# EAGLE design PSUProtector (EAGLE 7.6.0)
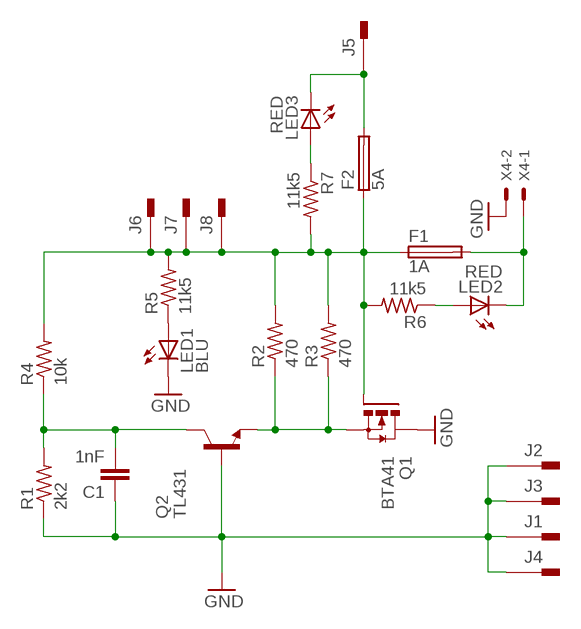
[diagram p0: schematic, sheet 1]

## Parts
C1  1nF  C-EU050-035X075  [C050-035X075]
F1  1A  TR5  [TR5]
F2  5A  TR5  [TR5]
J1  PIN2F061.040  [F061.040]
J2  PIN2F061.040  [F061.040]
J3  PIN2F061.040  [F061.040]
J4  PIN2F061.040  [F061.040]
J5  PIN2F061.040  [F061.040]
J6  PIN2F061.040  [F061.040]
J7  PIN2F061.040  [F061.040]
J8  PIN2F061.040  [F061.040]
LED1  BLU  LED5MM  [LED5MM]
LED2  RED  LED5MM  [LED5MM]
LED3  RED  LED5MM  [LED5MM]
Q1  BTA41  IRFP240  [TO247BV]
Q2  TL431  BC449  [TO92-EBC]
R1  2k2  R-US_0309/12  [0309/12]
R2  470  R-US_0411/15  [0411/15]
R3  470  R-US_0411/15  [0411/15]
R4  10k  R-US_0309/12  [0309/12]
R5  11k5  R-US_0309/12  [0309/12]
R6  11k5  R-US_0309/12  [0309/12]
R7  11k5  R-US_0309/12  [0309/12]
X4  KK-156-2  [KK-156-2]

## Nets
GND: C1.1 J1.A1 J1.A2 J2.A1 J2.A2 J3.A1 J3.A2 J4.A1 J4.A2 LED1.K(C) Q1.D Q2.B R1.1 X4.2
N$1: Q1.S Q2.E R2.1 R3.1
N$2: F1.1 F2.1 J6.A1 J6.A2 J7.A1 J7.A2 J8.A1 J8.A2 Q1.G R2.2 R3.2 R4.2 R5.2 R6.2 R7.2
N$3: C1.2 Q2.C R1.2 R4.1
N$4: LED3.A R7.1
N$5: F2.2 J5.A1 J5.A2 LED3.K(C)
N$6: LED1.A R5.1
N$7: F1.2 LED2.K(C) X4.1
N$8: LED2.A R6.1

## Library data of the parts
C1 = resistor:C-EU: CAPACITOR, European symbol
F1 F2 = fuse:TR5: FUSE Wickmann; OC_FARNELL: unknown; OC_NEWARK: unknown
J1-J8 = con-faston:PIN2: Flachstecker Typ Tyco/Electronics/AMP TAB, FASTON Printed Circuit Board Tabs Source: http://www.buerklin.com, http://catalog.tycoelectronics.com; OC_FARNELL: unknown; OC_NEWARK: unknown
LED1-LED3 = led:LED: LED OSRAM: - CHIPLED LG R971, LG N971, LY N971, LG Q971, LY Q971, LO R971, LY R971 LH N974, LH R974 LS Q976, LO Q976, LY Q976 LO Q996 - Hyper CHIPLED LW Q18S LB Q993, LB Q99A, LB R99A - SideLED LS A670, LO A670, LY A670, LG A670, LP A670 LB A673, LV A673, LT A673, LW A673 LH A674 LY A675 LS A676, LA A676, LO A676, LY A676, LW A676 LS A679, LY A679, LG A679 - Hyper Micro SIDELED® LS Y876, LA Y876, LO Y876, LY Y876 LT Y87S - SmartLED LW L88C, LW L88S LB L89C, LB L89S, LG L890 LS L89K, LO L89K, LY L89K LS L896, LA L896, LO L896, LY L896 - TOPLED LS T670, LO T670, LY T670, LG T670, LP T670 LSG T670, LSP T670, LSY T670, LOP T670, LYG T670 LG T671, LOG T671, LSG T671 LB T673, LV T673, LT T673, LW T673 LH T674 LS T676, LA T676, LO T676, LY T676, LB T676, LH T676, LSB T676, LW T676 LB T67C, LV T67C, LT T67C, LS T67K, LO T67K, LY T67K, LW E67C LS E67B, LA E67B, LO E67B, LY E67B, LB E67C, LV E67C, LT E67C LW T67C LS T679, LY T679, LG T679 LS T770, LO T770, LY T770, LG T770, LP T770 LB T773, LV T773, LT T773, LW T773 LH T774 LS E675, LA E675, LY E675, LS T675 LS T776, LA T776, LO T776, LY T776, LB T776 LHGB T686 LT T68C, LB T68C - Hyper Mini TOPLED® LB M676 - Mini TOPLED Santana® LG M470 LS M47K, LO M47K, LY M47K Source: http://www.osram.convergy.de LUXEON: - LUMILED® LXK2-PW12-R00, LXK2-PW12-S00, LXK2-PW14-U00, LXK2-PW14-V00 LXK2-PM12-R00, LXK2-PM12-S00, LXK2-PM14-U00 LXK2-PE12-Q00, LXK2-PE12-R00, LXK2-PE12-S00, LXK2-PE14-T00, LXK2-PE14-U00 LXK2-PB12-K00, LXK2-PB12-L00, LXK2-PB12-M00, LXK2-PB14-N00, LXK2-PB14-P00, LXK2-PB14-Q00 LXK2-PR12-L00, LXK2-PR12-M00, LXK2-PR14-Q00, LXK2-PR14-R00 LXK2-PD12-Q00, LXK2-PD12-R00, LXK2-PD12-S00 LXK2-PH12-R00, LXK2-PH12-S00 LXK2-PL12-P00, LXK2-PL12-Q00, LXK2-PL12-R00 Source: www.luxeon.com KINGBRIGHT: KA-3528ASYC Source: www.kingbright.com
Q1 = transistor-power:IRFP240: HEXFET Power MosFet Source: http://www.irf.com/
Q2 = transistor-npn:BC449*: NPN Transistor
R1-R7 = resistor:R-US_: RESISTOR, American symbol
X4 = con-molex:KK-156-2: KK 156 HEADER Source: http://www.molex.com/pdm_docs/sd/026604100_sd.pdf; OC_FARNELL: unknown; OC_NEWARK: unknown

## Board
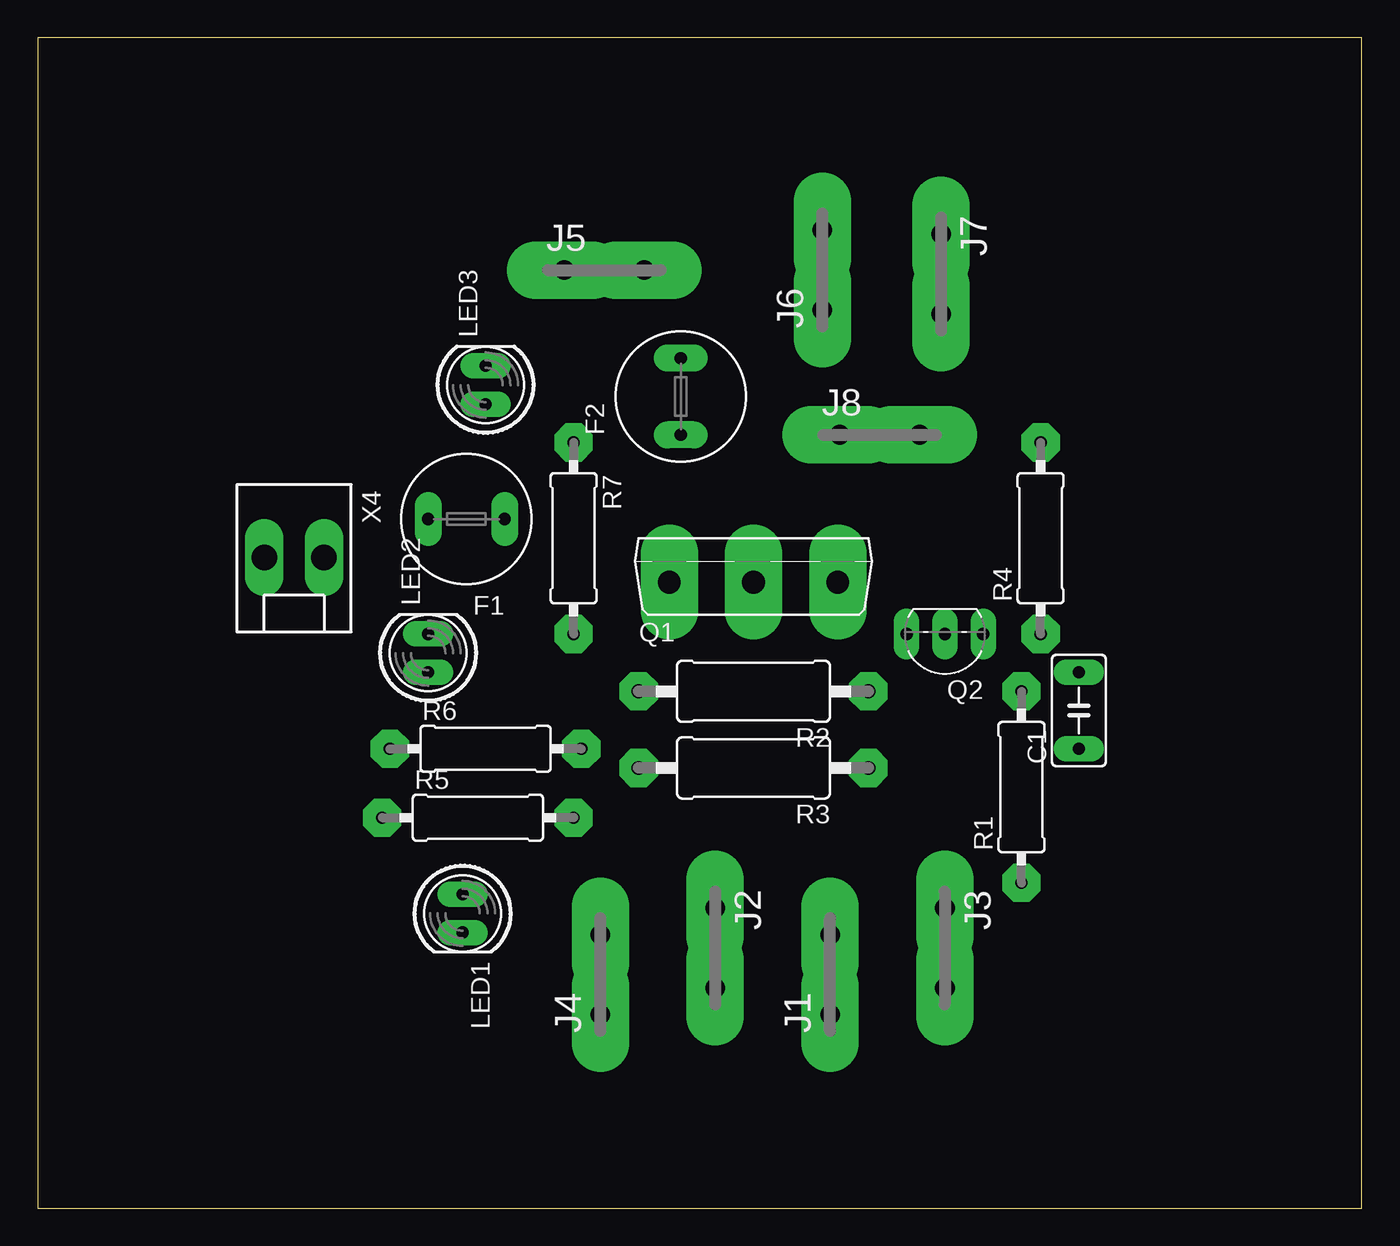
[diagram p1: board, top side]
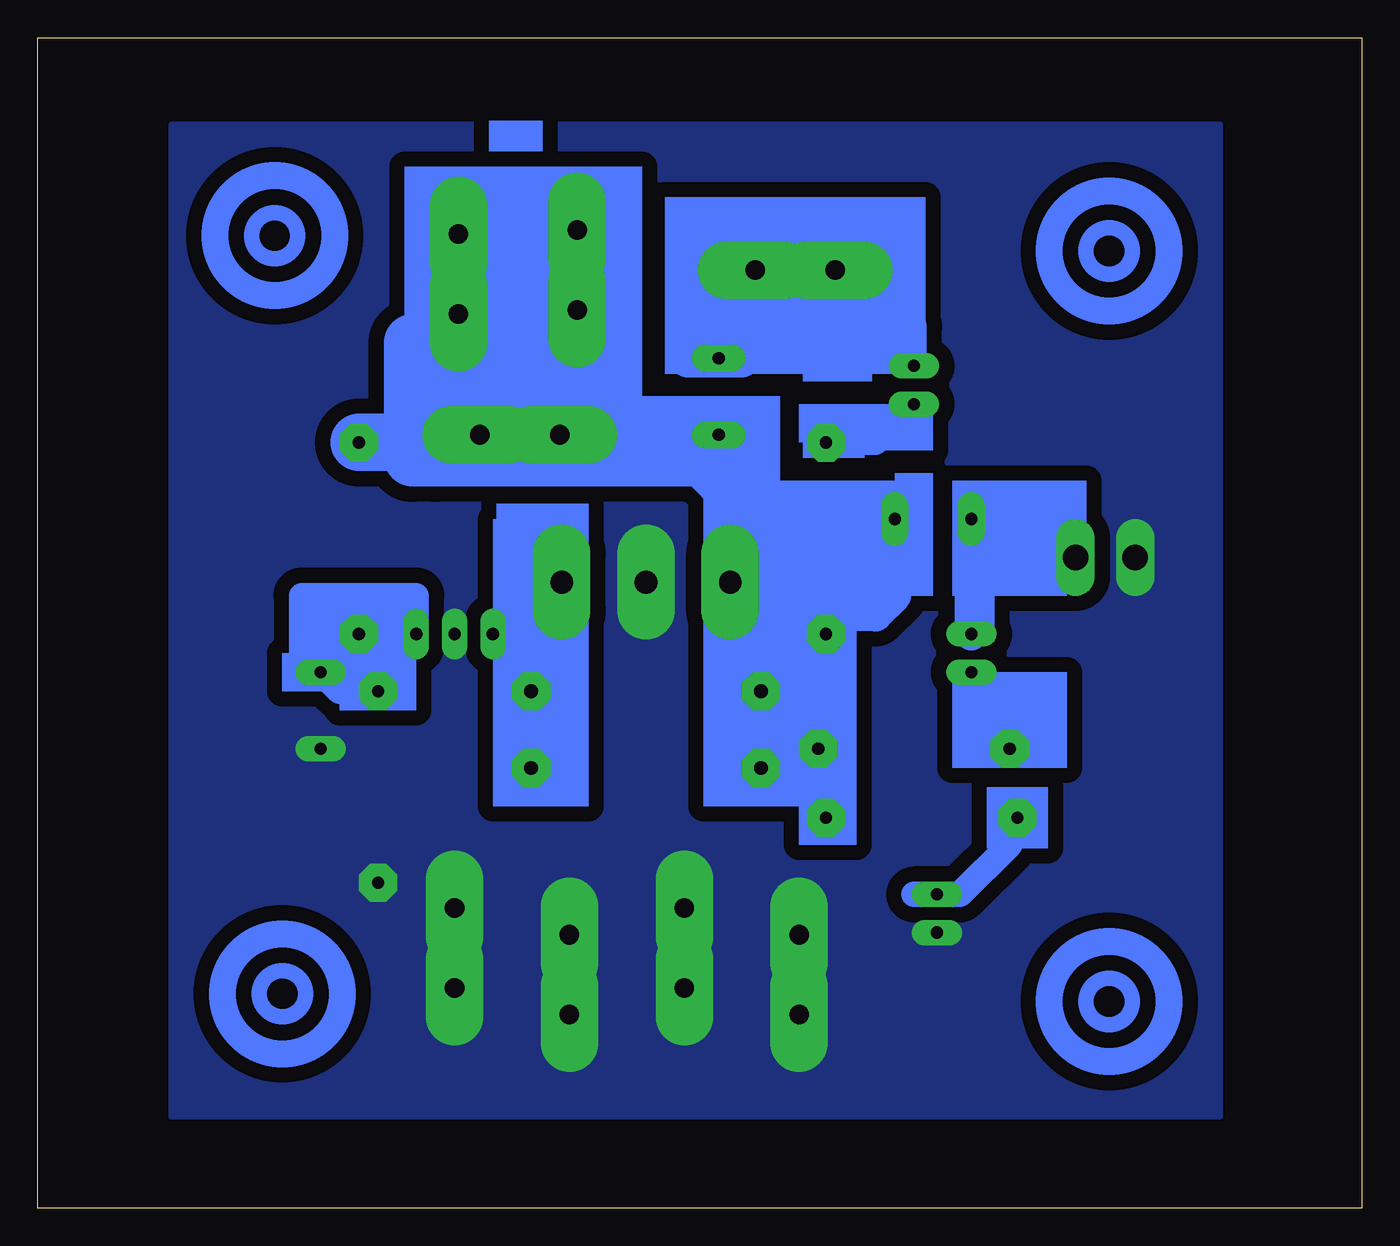
[diagram p2: board, bottom side, seen from below]

Size 87.86 x 77.65 mm. Coordinates in mm from the lower left corner, seen from the top.
Outline: 0,0 87.86,0 87.86,77.65 0,77.65 0,0
Copper layers (1*16): Top 0.035mm / dielectric 1.5mm / Bottom 0.035mm
Design rules "default": minimum track width 10mil, minimum drill 24mil, track to track 8mil, track to pad 8mil, pad to pad 8mil, via to via 8mil, smd to smd 8mil, copper to edge 40mil, drill to drill 8mil, minimum pad ring 10mil, minimum via ring 8mil, stop-mask expansion 4mil, vias tented up to drill 0mil, thermal gap 10mil

### Footprints (pad centres in the part's own frame; a part is rotated, then mirrored left to right if it is on the bottom)
C050-035X075 = drill 0.813 pad 1.676 long: 1 -2.54,0; 2 2.54,0
TR5 = drill 0.813 pad 1.778 long: 1 -2.54,0; 2 2.54,0
F061.040 = drill 1.3 pad 3.81 long: A1 -2.65,0; A2 2.65,0
LED5MM = drill 0.813 pad 1.676 long: A -1.27,0; K 1.27,0
TO247BV = drill 1.499 pad 3.81 long: D 0,-2.921; G -5.588,-2.921; S 5.588,-2.921
TO92-EBC = drill 0.813 pad 1.676 long: B 0,-1.27; C -2.54,-1.27; E 2.54,-1.27
0309/12 = drill 0.813 pad 2.54 octagon: 1 -6.35,0; 2 6.35,0
0411/15 = drill 0.914 pad 2.54 octagon: 1 -7.62,0; 2 7.62,0
KK-156-2 = drill 1.7 pad 2.184 long: 1 -1.98,0; 2 1.98,0

### Placement (x,y rotation side)
C1  69.09,33.02 90 top
F1  28.45,45.72 180 top
F2  42.67,53.85 90 top
J1  52.58,15.49 90 top
J2  44.96,17.27 270 top
J3  60.2,17.27 270 top
J4  37.34,15.49 90 top
J5  37.59,62.23 0 top
J6  52.07,62.23 90 top
J7  59.94,61.98 270 top
J8  55.88,51.31 0 top
LED1  28.19,19.56 270 top
LED2  25.91,36.83 90 top
LED3  29.72,54.61 90 top
Q1  47.5,44.45 0 top
Q2  60.2,36.83 180 top
R1  65.28,27.94 90 top
R2  47.5,34.29 180 top
R3  47.5,29.21 180 top
R4  66.55,44.45 90 top
R5  29.21,25.91 0 top
R6  29.72,30.48 0 top
R7  35.56,44.45 270 top
X4  17.02,43.18 180 top

### Tracks (layer width: path | path; a pad name or v marks a point on that pad's centre or on a via)
GND
  pour Bottom (isolate 1.016, no thermals): 9.4,71.88 78.99,71.88 78.99,6.1 9.4,6.1
N$1
  Bottom 1.676: R3.1 R2.1 55.12,36.83 55.12,38.1 | 55.12,38.1 55.12,39.5 Q1.S | Q2.E 55.12,38.1
N$2
  Bottom 1.016: J6.A1 53.96,61.47 56.9,61.47 56.39,60.96 | 61.47,50.29 60.45,51.31 J8.A2 J8.A1
  Bottom 1.778: F2.1 43.69,50.29 44.7,50.29 44.7,49.78
  Bottom 2.184: 30.99,46.99 F1.1 30.99,40.64 32.26,39.37 36.07,39.37 | 36.07,39.37 39.75,39.37 Q1.G | R7.2 36.07,39.37 | R3.2 R2.2 | R2.2 39.88,35.56 36.07,39.37 | R6.2 37.97,32.38 | 37.97,32.38 R2.2 | R5.2 36.07,27.94 38.61,30.48 38.61,31.75 37.97,32.38
  Bottom 3.81: Q1.G 41.15,42.29 41.15,47.24 43.69,49.78 44.7,49.78 61.47,49.78 | 61.47,49.78 62.99,49.78 62.99,57.4 59.33,58.02 | 59.33,58.02 56.39,60.96 56.02,61.32 J6.A2 | J7.A2 J7.A1 59.33,58.02 | R4.2 61.98,50.8 61.47,50.29 61.47,49.78
N$3
  Bottom 1.676: Q2.C 62.74,40.64 70.36,40.64 70.36,36.83 C1.2 | R1.2 67.82,34.29 C1.2 | C1.2 R4.1
N$4
  Bottom 1.676: R7.1 32.26,50.8 LED3.A
N$5
  Bottom 1.676: LED3.K 29.72,58.53 J5.A1
  Bottom 2.54: 44.7,56.39 F2.2 41.15,56.39 36.07,61.47 36.07,62.48 36.32,62.23 | J5.A2 36.32,62.23 | 36.32,62.23 J5.A1
N$6
  Bottom 1.676: 29.72,20.83 LED1.A 26.67,20.83 23.37,24.13 R5.1
N$7
  Bottom 2.184: X4.1 23.37,43.18 | 23.37,43.18 F1.2 | LED2.K 25.91,40.64 23.37,43.18
N$8
  Bottom 1.676: LED2.A 23.37,33.02 R6.1
(copper drawn outside any net)
  shapes: Bottom area x67, Bottom circle x8